# Altium schematic sheet Digital.SchDoc
size 381 x 241 mm
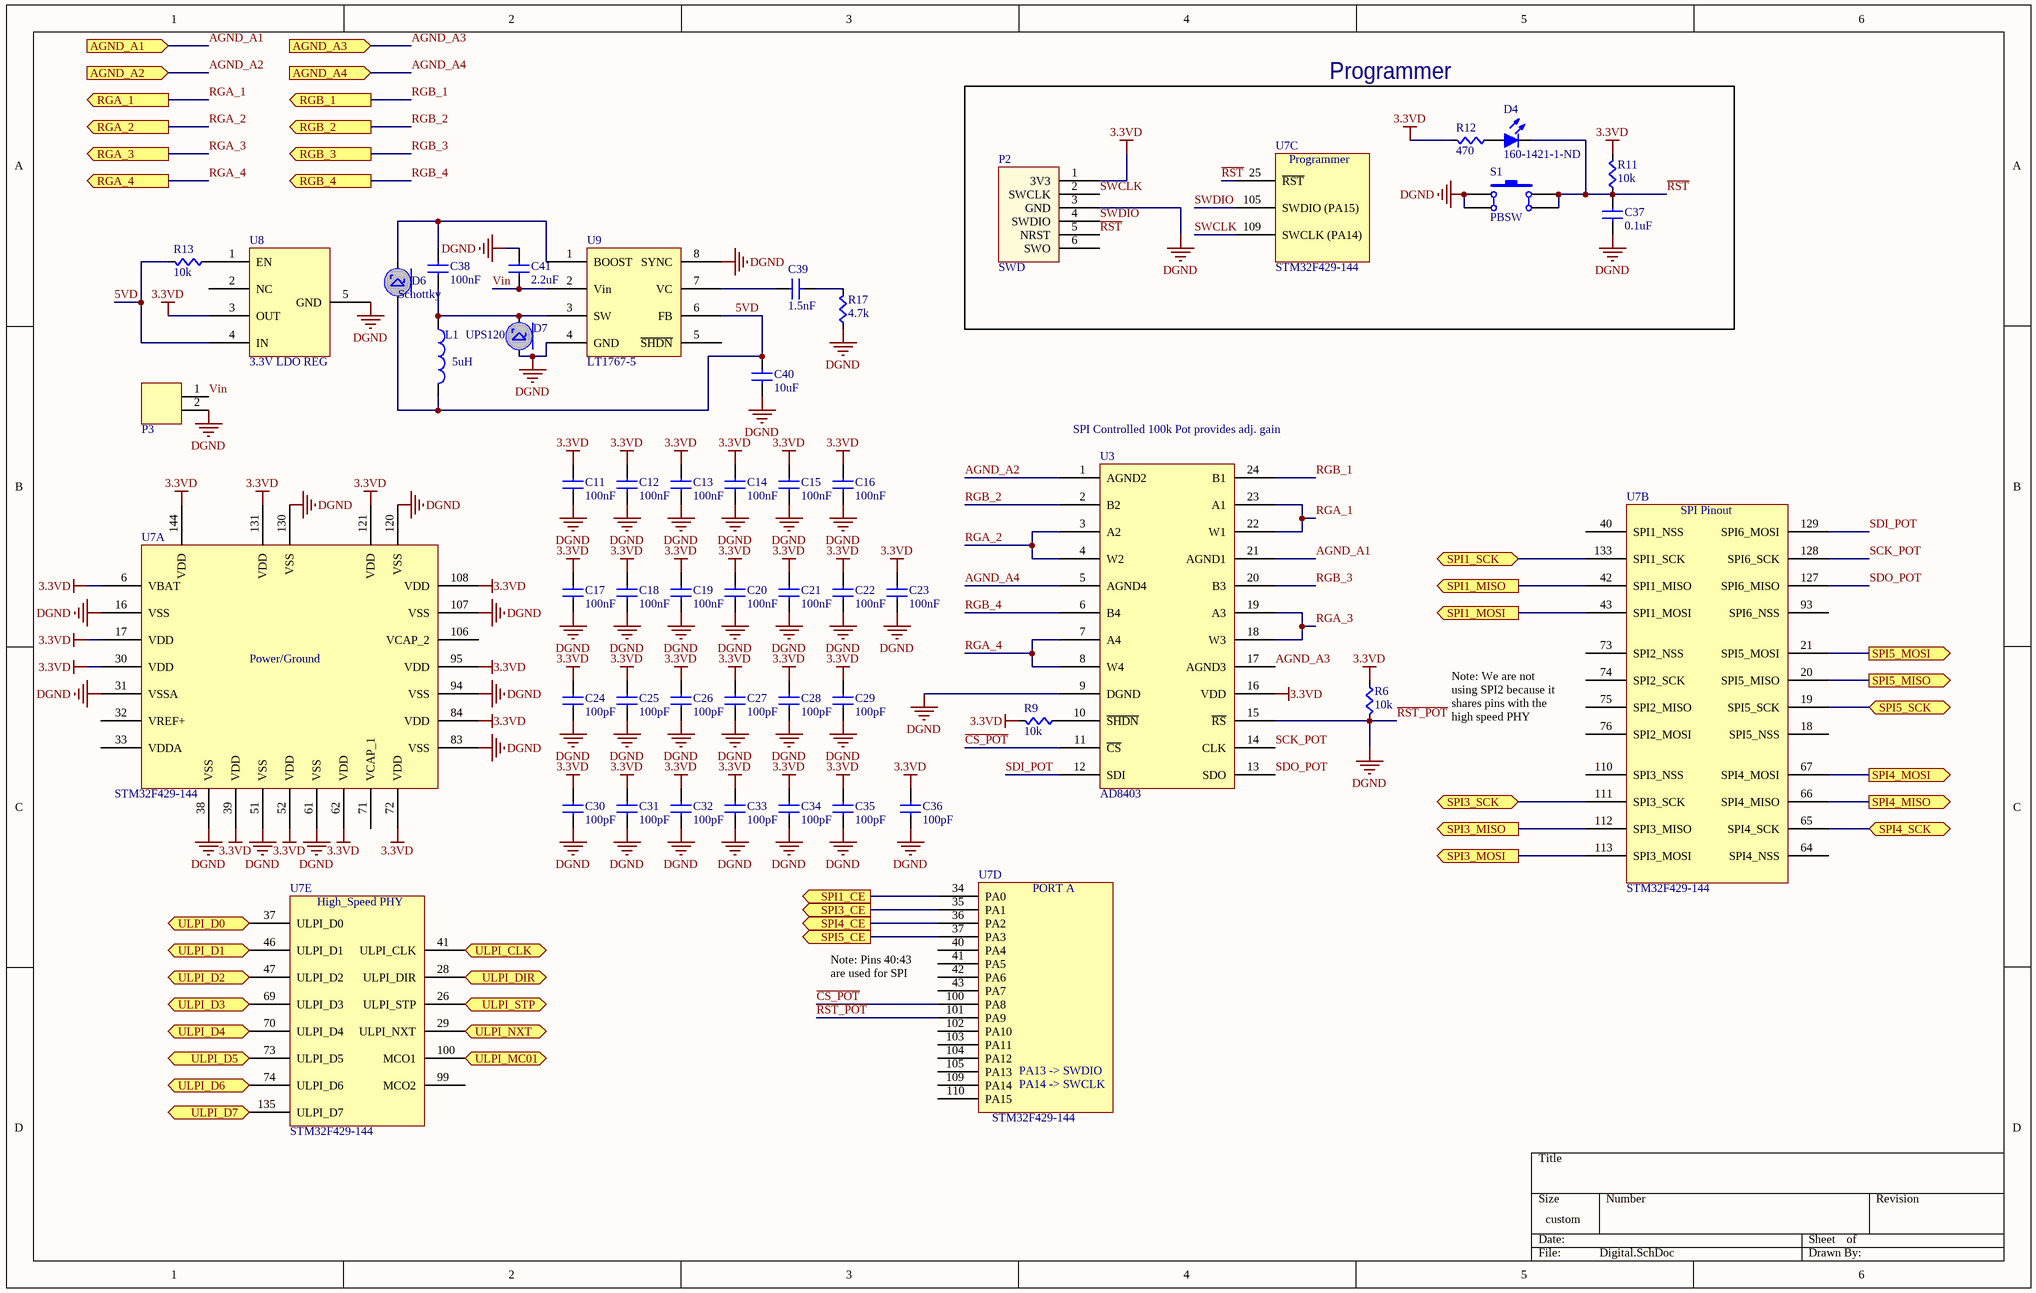
[diagram p0: Digital.SchDoc]

## Parts
C11  value 100nF  [CAPC0603]  (hidden comment: Cap)
C12  value 100nF  [CAPC0603]  (hidden comment: Cap)
C13  value 100nF  [CAPC0603]  (hidden comment: Cap)
C14  value 100nF  [CAPC0603]  (hidden comment: Cap)
C15  value 100nF  [CAPC0603]  (hidden comment: Cap)
C16  value 100nF  [CAPC0603]  (hidden comment: Cap)
C17  value 100nF  [CAPC0603]  (hidden comment: Cap)
C18  value 100nF  [CAPC0603]  (hidden comment: Cap)
C19  value 100nF  [CAPC0603]  (hidden comment: Cap)
C20  value 100nF  [CAPC0603]  (hidden comment: Cap)
C21  value 100nF  [CAPC0603]  (hidden comment: Cap)
C22  value 100nF  [CAPC0603]  (hidden comment: Cap)
C23  value 100nF  [CAPC0603]  (hidden comment: Cap)
C24  value 100pF  [CAPC0603]  (hidden comment: Cap)
C25  value 100pF  [CAPC0603]  (hidden comment: Cap)
C26  value 100pF  [CAPC0603]  (hidden comment: Cap)
C27  value 100pF  [CAPC0603]  (hidden comment: Cap)
C28  value 100pF  [CAPC0603]  (hidden comment: Cap)
C29  value 100pF  [CAPC0603]  (hidden comment: Cap)
C30  value 100pF  [CAPC0603]  (hidden comment: Cap)
C31  value 100pF  [CAPC0603]  (hidden comment: Cap)
C32  value 100pF  [CAPC0603]  (hidden comment: Cap)
C33  value 100pF  [CAPC0603]  (hidden comment: Cap)
C34  value 100pF  [CAPC0603]  (hidden comment: Cap)
C35  value 100pF  [CAPC0603]  (hidden comment: Cap)
C36  value 100pF  [CAPC0603]  (hidden comment: Cap)
C37  value 0.1uF  [CAPC0603]  (hidden comment: Cap)
C38  value 100nF  [CAPC0603]  (hidden comment: Cap)
C39  value 1.5nF  [CAPC0603]  (hidden comment: Cap)
C40  value 10uF  [CAPC0603]  (hidden comment: Cap)
C41  value 2.2uF  [CAPC0603]  (hidden comment: Cap)
D4  Supplier Part Number: 160-1421-1-ND  [LED0805-RED]  (hidden comment: LED-RED)
D6  Schottky  [SOD-323F]
D7  UPS120  [DO-216AA]
L1  5uH  [IND_2]
P2  SWD  [SWD_STM32]
P3  2-pin Horz Sherlock  [MOLEX-HDR-1X2-SHERLOCK-HORZ]  (value not drawn)
R6  value 10k  [RES0603]  (hidden comment: Res)
R9  value 10k  [RES0603]  (hidden comment: Res)
R11  value 10k  [RES0603]  (hidden comment: Res)
R12  value 470  [RES0603]  (hidden comment: Res)
R13  value 10k  [RES0603]  (hidden comment: Res)
R17  value 4.7k  [RES0603]  (hidden comment: Res)
S1  PBSW  [PBSW]
U3  AD8403  [SOIC-24n]
U7  STM32F429-144  [LQFP-144]  (parts A,B,C,D,E of 5)
U8  3.3V LDO REG  [SOT223-8N]
U9  LT1767-5  [MSOP-8n]

## Blocks framed on the sheet
Programmer: C37 D4 P2 R11 R12 S1 U7

## Ports
AGND_A1 (in), AGND_A2 (in), AGND_A3 (in), AGND_A4 (in), RGA_1 (out), RGA_2 (out), RGA_3 (out), RGA_4 (out), RGB_1 (out), RGB_2 (out), RGB_3 (out), RGB_4 (out), SPI1_CE (out), SPI1_MISO (out), SPI1_MOSI (out), SPI1_SCK (bidir), SPI3_CE (out), SPI3_MISO (out), SPI3_MOSI (out), SPI3_SCK (bidir), SPI4_CE (out), SPI4_MISO (out), SPI4_MOSI (out), SPI4_SCK (bidir), SPI5_CE (out), SPI5_MISO (out), SPI5_MOSI (out), SPI5_SCK (bidir), ULPI_CLK (bidir), ULPI_D0 (bidir), ULPI_D1 (bidir), ULPI_D2 (bidir), ULPI_D3 (bidir), ULPI_D4 (bidir), ULPI_D5 (bidir), ULPI_D6 (bidir), ULPI_D7 (bidir), ULPI_DIR (bidir), ULPI_MC01 (bidir), ULPI_NXT (bidir), ULPI_STP (bidir)

## Nets
1: S1.2(A')
3: S1.4(B')
3.3VD: C11.1(A) C12.1(A) C13.1(A) C14.1(A) C15.1(A) C16.1(A) C17.1(A) C18.1(A) C19.1(A) C20.1(A) C21.1(A) C22.1(A) C23.1(A) C24.1(A) C25.1(A) C26.1(A) C27.1(A) C28.1(A) C29.1(A) C30.1(A) C31.1(A) C32.1(A) C33.1(A) C34.1(A) C35.1(A) C36.1(A) P2.1(3V3) R6.2(B) R9.1(A) R11.1(A) R12.1(A) U3.16(VDD) U7.6(VBAT) U7.17(VDD) U7.30(VDD) U7.39(VDD) U7.52(VDD) U7.62(VDD) U7.72(VDD) U7.84(VDD) U7.95(VDD) U7.108(VDD) U7.121(VDD) U7.131(VDD) U7.144(VDD) U8.3(OUT)
~{RST_POT}: C11.2(B) C12.2(B) C13.2(B) C14.2(B) C15.2(B) C16.2(B) C17.2(B) C18.2(B) C19.2(B) C20.2(B) C21.2(B) C22.2(B) C23.2(B) C24.2(B) C25.2(B) C26.2(B) C27.2(B) C28.2(B) C29.2(B) C30.2(B) C31.2(B) C32.2(B) C33.2(B) C34.2(B) C35.2(B) C36.2(B) C37.2(B) C40.2(B) C41.2(B) D7.A P2.3(GND) P3.2 R6.1(A) R17.2(B) S1.1(A) S1.2(A') U3.9(DGND) U3.15(~{RS}) U7.16(VSS) U7.31(VSSA) U7.38(VSS) U7.51(VSS) U7.61(VSS) U7.83(VSS) U7.94(VSS) U7.101(PA9) U7.107(VSS) U7.120(VSS) U7.130(VSS) U8.5(GND) U9.4(GND) U9.8(SYNC)  [also labelled DGND]
5VD: C40.1(A) D6.A L1.2(B) R13.1(A) U8.4(IN) U9.6(FB)
AGND_A1: U3.21(AGND1) ; port AGND_A1
AGND_A2: U3.1(AGND2) ; port AGND_A2
AGND_A3: U3.17(AGND3) ; port AGND_A3
AGND_A4: U3.5(AGND4) ; port AGND_A4
~{CS_POT}: U3.11(~{CS}) U7.100(PA8)
~{RST}: C37.1(A) D4.1(K) P2.5(NRST) R11.2(B) S1.3(B) S1.4(B') U7.25(~{RST})
RGA_1: U3.22(W1) U3.23(A1) ; port RGA_1
RGA_2: U3.3(A2) U3.4(W2) ; port RGA_2
RGA_3: U3.18(W3) U3.19(A3) ; port RGA_3
RGA_4: U3.7(A4) U3.8(W4) ; port RGA_4
RGB_1: U3.24(B1) ; port RGB_1
RGB_2: U3.2(B2) ; port RGB_2
RGB_3: U3.20(B3) ; port RGB_3
RGB_4: U3.6(B4) ; port RGB_4
SCK_POT: U3.14(CLK) U7.128(SPI6_SCK)
SDI_POT: U3.12(SDI) U7.129(SPI6_MOSI)
SDO_POT: U3.13(SDO) U7.127(SPI6_MISO)
SPI1_CE: U7.34(PA0) ; port SPI1_CE
SPI1_MISO: U7.42(SPI1_MISO) ; port SPI1_MISO
SPI1_MOSI: U7.43(SPI1_MOSI) ; port SPI1_MOSI
SPI1_SCK: U7.133(SPI1_SCK) ; port SPI1_SCK
SPI3_CE: U7.35(PA1) ; port SPI3_CE
SPI3_MISO: U7.112(SPI3_MISO) ; port SPI3_MISO
SPI3_MOSI: U7.113(SPI3_MOSI) ; port SPI3_MOSI
SPI3_SCK: U7.111(SPI3_SCK) ; port SPI3_SCK
SPI4_CE: U7.36(PA2) ; port SPI4_CE
SPI4_MISO: U7.66(SPI4_MISO) ; port SPI4_MISO
SPI4_MOSI: U7.67(SPI4_MOSI) ; port SPI4_MOSI
SPI4_SCK: U7.65(SPI4_SCK) ; port SPI4_SCK
SPI5_CE: U7.37(PA3) ; port SPI5_CE
SPI5_MISO: U7.20(SPI5_MISO) ; port SPI5_MISO
SPI5_MOSI: U7.21(SPI5_MOSI) ; port SPI5_MOSI
SPI5_SCK: U7.19(SPI5_SCK) ; port SPI5_SCK
SWCLK: P2.2(SWCLK) U7.109(SWCLK_(PA14))
SWDIO: P2.4(SWDIO) U7.105(SWDIO_(PA15))
ULPI_CLK: U7.41(ULPI_CLK) ; port ULPI_CLK
ULPI_D0: U7.37(ULPI_D0) ; port ULPI_D0
ULPI_D1: U7.46(ULPI_D1) ; port ULPI_D1
ULPI_D2: U7.47(ULPI_D2) ; port ULPI_D2
ULPI_D3: U7.69(ULPI_D3) ; port ULPI_D3
ULPI_D4: U7.70(ULPI_D4) ; port ULPI_D4
ULPI_D5: U7.73(ULPI_D5) ; port ULPI_D5
ULPI_D6: U7.74(ULPI_D6) ; port ULPI_D6
ULPI_D7: U7.135(ULPI_D7) ; port ULPI_D7
ULPI_DIR: U7.28(ULPI_DIR) ; port ULPI_DIR
ULPI_MC01: U7.100(MCO1) ; port ULPI_MC01
ULPI_NXT: U7.29(ULPI_NXT) ; port ULPI_NXT
ULPI_STP: U7.26(ULPI_STP) ; port ULPI_STP
Vin: C41.1(A) P3.1 U9.2(Vin)
NetC38_1: C38.1(A) D6.C U9.1(BOOST)
NetC38_2: C38.2(B) D7.C L1.1(A) U9.3(SW)
NetC39_1: C39.1(A) U9.7(VC)
NetC39_2: C39.2(B) R17.1(A)
NetD4_2: D4.2(A) R12.2(B)
NetR9_2: R9.2(B) U3.10(~{SHDN})
NetR13_2: R13.2(B) U8.1(EN)

Not connected (* = marked no-connect by the designer): P2 6(SWO); U7 18(SPI5_NSS) 32(VREF+) 33(VDDA) 40(SPI1_NSS) 64(SPI4_NSS) 71(VCAP_1) 75(SPI2_MISO) 76(SPI2_MOSI) 93(SPI6_NSS) 99(MCO2) 102(PA10) 103(PA11) 104(PA12) 106(VCAP_2) 110(SPI3_NSS); U8 2(NC); U9 5(~{SHDN})

## Notes on the sheet
- (near U3) SPI Controlled 100k Pot provides adj. gain
- Note: We are not using SPI2 because it shares pins with the high speed PHY
- Note: Pins 40:43 are used for SPI
- (in symbol STM32F429-144, part A) Power/Ground
- (in symbol STM32F429-144, part B) SPI Pinout
- (in symbol STM32F429-144, part C) Programmer
- (in symbol STM32F429-144, part D) PORT A; PA13 -> SWDIO; PA14 -> SWCLK
- (in symbol STM32F429-144, part E) High_Speed PHY

## Library data of the parts
D4 = LED-RED: Light Emitting Diode - RED; Manufacturer Part Number: LTST-C171CKT; Manufacturer: Lite-On Inc; Voltage - Forward (Vf) Typ: 1.8V; Current - Test: 20mA; Millicandela Rating: 25mcd; Viewing Angle: 130°; Color: Red; Supplier: Digi-Key; Package / Case: 0805 (2012 Metric)
D6 = CMDSH-3: DIODE SCHOTTKY 30V 100MA SOD323; Supplier 1: Digi-Key; Supplier Part Number 1: CMDSH-3 CT-ND
D7 = UPS120: DIODE SCHOTTKY 20V 1A POWERMITE1; Supplier 1: Digi-Key; Supplier Part Number 1: UPS120E3CT-ND
L1 = SRR1206-5R0ML: FIXED IND 5UH 4.7A 22 MOHM SMD; Supplier 1: Digi-Key; Supplier Part Number 1: SRR1206-5R0MLCT-ND
P2 = SWD_STM32: SWD connector matching the pinout on STM Discovery Boards
P3 = MOLEX-HDR-1x2-SHERLOCK_RA: Header, Molex, 2mm Pitch Sherlock Header, Single Row, Horizontal, 2 Circuits, Length 3.3mm,  0353630260; Manufacturer: Molex Inc; Manufacturer Part Number: 0353630260; Supplier Part Number 1: WM18931-ND; Supplier 1: Digi-Key
S1 = SW-PB: Push Button Switch; Manufacturer: Panasonic Electronic Components; Manufacturer Part Number: EVQ-9P105M; Outline: 6.10mm x 6.00mm; Actuator Orientation: Top Actuated; Actuator Height off PCB, from Pins: 5.00mm; Published: 24-Mar-1999; LatestRevisionDate: 17-Jul-2002; LatestRevisionNote: Re-released for DXP Platform.; PackageReference: SPST-2; Publisher: Altium Limited; PackageDescription: Switch; 2 Leads; Supplier: Digi-Key; Supplier Part Number: P13586SCT-ND
U3 = AD8403: IC POT DGTL 8BIT 100K 4CH 24SOIC; Supplier 1: Digi-Key; Supplier Part Number 1: AD8403ARZ100-ND
U7 = STM32F429-144: IC MCU ARM 2MB FLASH 144LQFP; Supplier 1: Digi-Key; Supplier Part Number 1: 497-14053-ND
U8 = LP38691: IC REG LDO 3.3V 0.5A SOT223-5; Supplier 1: Digi-Key; Supplier Part Number 1: LP38693MP-3.3/NOPBCT-ND
U9 = LT1767-5: IC REG BUCK 5V 1.5A 8MSOP; Supplier 1: Digi-Key; Supplier Part Number 1: LT1767EMS8-5#PBF-ND
C11-C41 = Cap: Supplier 1: Digi-Key; Supplier Part Number 1: 1276-1000-1-ND
R6 R9 R11-R13 R17 = Res: Supplier 1: Digi-Key; Supplier Part Number 1: RMCF0603JT10K0CT-ND